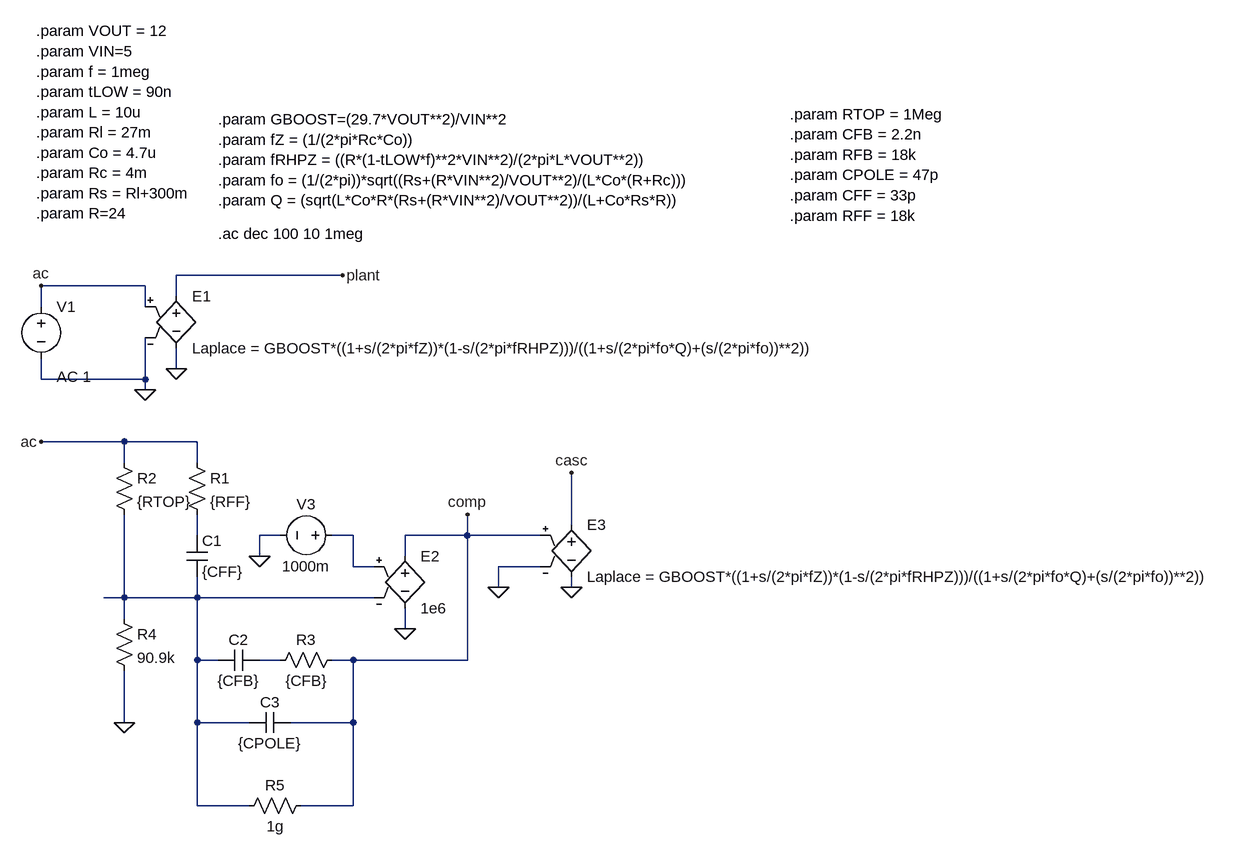
[diagram p0: schematic ltc3115-1-tf-boost.asc]
ltc3115-1-tf-boost.asc, the LTspice schematic file:
Version 4.1
SHEET 1 2740 976
WIRE 112 48 -144 48
WIRE -192 64 -352 64
WIRE -144 80 -144 48
WIRE -352 96 -352 64
WIRE -192 96 -192 64
WIRE -144 192 -144 160
WIRE -352 208 -352 176
WIRE -192 208 -192 144
WIRE -192 208 -352 208
WIRE -192 224 -192 208
WIRE -224 304 -352 304
WIRE -112 304 -224 304
WIRE -224 336 -224 304
WIRE -112 336 -112 304
WIRE 464 432 464 352
WIRE -112 448 -112 416
WIRE 16 448 -16 448
WIRE 128 448 96 448
WIRE 304 448 304 416
WIRE 304 448 208 448
WIRE 416 448 304 448
WIRE -16 480 -16 448
WIRE 208 480 208 448
WIRE 128 496 128 448
WIRE 160 496 128 496
WIRE 416 496 352 496
WIRE 352 528 352 496
WIRE 464 528 464 512
WIRE -224 544 -224 416
WIRE -224 544 -256 544
WIRE -112 544 -112 512
WIRE -112 544 -224 544
WIRE 160 544 -112 544
WIRE -224 576 -224 544
WIRE 208 592 208 560
WIRE -112 640 -112 544
WIRE -80 640 -112 640
WIRE 16 640 -16 640
WIRE 128 640 96 640
WIRE 304 640 304 448
WIRE 304 640 128 640
WIRE -224 736 -224 656
WIRE -112 736 -112 640
WIRE -32 736 -112 736
WIRE 128 736 128 640
WIRE 128 736 32 736
WIRE -112 864 -112 736
WIRE -32 864 -112 864
WIRE 128 864 128 736
WIRE 128 864 48 864
FLAG -144 192 0
FLAG 112 48 plant
FLAG -192 224 0
FLAG -224 736 0
FLAG -16 480 0
FLAG 208 592 0
FLAG 304 416 comp
FLAG -352 64 ac
FLAG -352 304 ac
FLAG 352 528 0
FLAG 464 528 0
FLAG 464 352 casc
SYMBOL e -144 64 R0
SYMATTR InstName E1
SYMATTR Value Laplace = GBOOST*((1+s/(2*pi*fZ))*(1-s/(2*pi*fRHPZ)))/((1+s/(2*pi*fo*Q)+(s/(2*pi*fo))**2))
SYMBOL voltage -352 80 R0
WINDOW 123 24 124 Left 2
WINDOW 39 0 0 Left 0
SYMATTR Value2 AC 1
SYMATTR InstName V1
SYMATTR Value ""
SYMBOL cap -128 448 R0
SYMATTR InstName C1
SYMATTR Value {CFF}
SYMBOL res -128 320 R0
SYMATTR InstName R1
SYMATTR Value {RFF}
SYMBOL res -240 320 R0
SYMATTR InstName R2
SYMATTR Value {RTOP}
SYMBOL cap -16 624 R90
WINDOW 0 0 32 VBottom 2
WINDOW 3 32 32 VTop 2
SYMATTR InstName C2
SYMATTR Value {CFB}
SYMBOL res 112 624 R90
WINDOW 0 0 56 VBottom 2
WINDOW 3 32 56 VTop 2
SYMATTR InstName R3
SYMATTR Value {CFB}
SYMBOL cap 32 720 R90
WINDOW 0 0 32 VBottom 2
WINDOW 3 32 32 VTop 2
SYMATTR InstName C3
SYMATTR Value {CPOLE}
SYMBOL res -240 560 R0
SYMATTR InstName R4
SYMATTR Value 90.9k
SYMBOL voltage 112 448 R90
WINDOW 0 -32 56 VBottom 2
WINDOW 3 32 56 VTop 2
WINDOW 123 0 0 Left 0
WINDOW 39 0 0 Left 0
SYMATTR InstName V3
SYMATTR Value 1000m
SYMBOL e 208 464 R0
SYMATTR InstName E2
SYMATTR Value 1e6
SYMBOL res 64 848 R90
WINDOW 0 0 56 VBottom 2
WINDOW 3 32 56 VTop 2
SYMATTR InstName R5
SYMATTR Value 1g
SYMBOL e 464 416 R0
SYMATTR InstName E3
SYMATTR Value Laplace = GBOOST*((1+s/(2*pi*fZ))*(1-s/(2*pi*fRHPZ)))/((1+s/(2*pi*fo*Q)+(s/(2*pi*fo))**2))
TEXT -80 -16 Left 2 !.ac dec 100 10 1meg
TEXT -80 -192 Left 2 !.param GBOOST=(29.7*VOUT**2)/VIN**2\n.param fZ = (1/(2*pi*Rc*Co))\n.param fRHPZ = ((R*(1-tLOW*f)**2*VIN**2)/(2*pi*L*VOUT**2))\n.param fo = (1/(2*pi))*sqrt((Rs+(R*VIN**2)/VOUT**2)/(L*Co*(R+Rc)))\n.param Q = (sqrt(L*Co*R*(Rs+(R*VIN**2)/VOUT**2))/(L+Co*Rs*R))
TEXT -360 -328 Left 2 !.param VOUT = 12\n.param VIN=5\n.param f = 1meg\n.param tLOW = 90n\n.param L = 10u\n.param Rl = 27m\n.param Co = 4.7u\n.param Rc = 4m\n.param Rs = Rl+300m\n.param R=24
TEXT 800 -200 Left 2 !.param RTOP = 1Meg\n.param CFB = 2.2n\n.param RFB = 18k\n.param CPOLE = 47p\n.param CFF = 33p\n.param RFF = 18k

The netlist it stands for:
* ltc3115-1-tf-boost.asc
E1 plant 0 ac 0 Laplace = GBOOST*((1+s/(2*pi*fZ))*(1-s/(2*pi*fRHPZ)))/((1+s/(2*pi*fo*Q)+(s/(2*pi*fo))**2))
V1 ac 0 AC 1
C1 N001 N003 {CFF}
R1 ac N001 {RFF}
R2 ac N003 {RTOP}
C2 N004 N003 {CFB}
R3 comp N004 {CFB}
C3 comp N003 {CPOLE}
R4 N003 0 90.9k
V3 N002 0 1000m
E2 comp 0 N002 N003 1e6
R5 comp N003 1g
E3 casc 0 comp 0 Laplace = GBOOST*((1+s/(2*pi*fZ))*(1-s/(2*pi*fRHPZ)))/((1+s/(2*pi*fo*Q)+(s/(2*pi*fo))**2))
.ac dec 100 10 1meg
.param GBOOST=(29.7*VOUT**2)/VIN**2
.param fZ = (1/(2*pi*Rc*Co))
.param fRHPZ = ((R*(1-tLOW*f)**2*VIN**2)/(2*pi*L*VOUT**2))
.param fo = (1/(2*pi))*sqrt((Rs+(R*VIN**2)/VOUT**2)/(L*Co*(R+Rc)))
.param Q = (sqrt(L*Co*R*(Rs+(R*VIN**2)/VOUT**2))/(L+Co*Rs*R))
.param VOUT = 12
.param VIN=5
.param f = 1meg
.param tLOW = 90n
.param L = 10u
.param Rl = 27m
.param Co = 4.7u
.param Rc = 4m
.param Rs = Rl+300m
.param R=24
.param RTOP = 1Meg
.param CFB = 2.2n
.param RFB = 18k
.param CPOLE = 47p
.param CFF = 33p
.param RFF = 18k
.backanno
.end